# EasyEDA Pro project PCB.eprj, schematic Flags_Register
Board Name: Flags_Register; Create Date: 2025-08-07; Page Name: P1; Project Name: PCB; Schematic Name: Flags_Register; Update Date: 2025-08-12; Company: EasyEDA.com; Page Size: A4; Version: V1.0
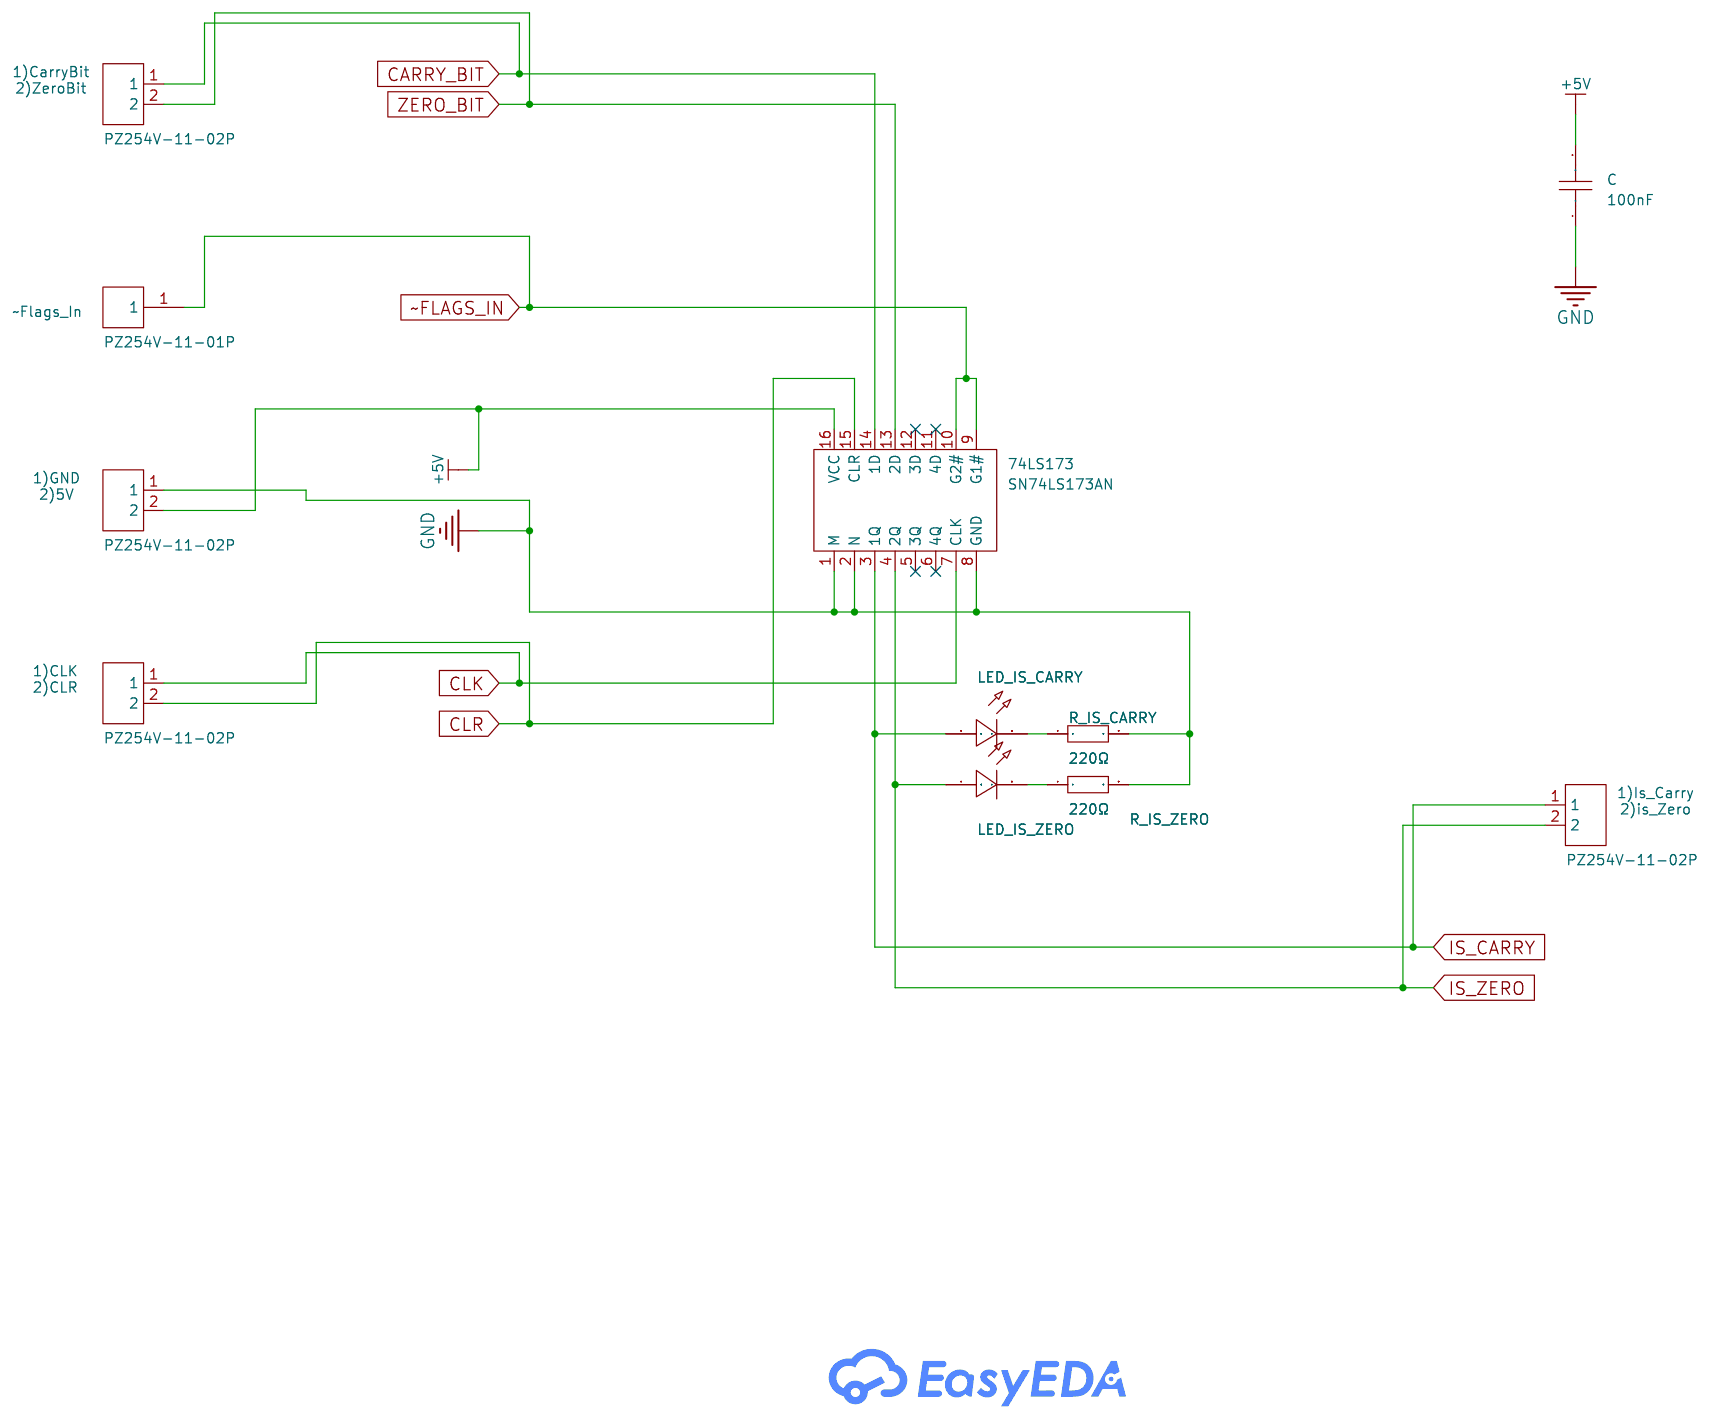
[diagram p2: schematic sheet]

## Parts
1)CarryBit
2)ZeroBit  PZ254V-11-02P  [HDR-TH_2P-P2.54-V-M]
1)CLK
2)CLR  PZ254V-11-02P  [HDR-TH_2P-P2.54-V-M]
1)GND
2)5V  PZ254V-11-02P  [HDR-TH_2P-P2.54-V-M]
1)Is_Carry
2)is_Zero  PZ254V-11-02P  [HDR-TH_2P-P2.54-V-M]
74LS173  SN74LS173AN  [PDIP-16_L19.3-W6.4-P2.54-LS7.94-BL]
C  100nF  [CAP-TH_L8.5-W5.0-P5.00-D1.2]
LED_IS_CARRY  -  [LED-TH_BD5.8-P2.54-FD]
LED_IS_ZERO  -  [LED-TH_BD5.8-P2.54-FD]
R_IS_CARRY  220Ω  [R_AXIAL-0.4]
R_IS_ZERO  220Ω  [R_AXIAL-0.4]
~Flags_In  PZ254V-11-01P  [HDR-TH_1P-P2.54-V-M]

## Library data of the parts
1)CarryBit
2)ZeroBit 1)CLK
2)CLR 1)GND
2)5V 1)Is_Carry
2)is_Zero = PZ254V-11-02P: LCSC Part Name: 1x2P 间距:2.54mm 方针 直插; Supplier Part: C492401; Manufacturer: XFCN(兴飞); Supplier Footprint: 插件,P=2.54mm; JLCPCB Part Class: Extended Part; Datasheet: https://atta.szlcsc.com/upload/public/pdf/source/20200309/C492401_A812433581A9B211A7FFA413ADDFF0E5.pdf; Supplier: LCSC; Pin Structure: 1x2P; Pitch: 2.54mm; Circluar Pins/Square Pins: Policy; Mounting Type: Straight; Number of Rows: Single Row; Number of Pins: 2P; Length of Mating Pin: 6mm; Insulation Height: 2.5mm; Length of End Connection Pin: 3mm; Contact Material: Brass; Operating Temperature: -40℃~+105℃; Color: Black
74LS173 = SN74LS173AN: Type:D-Type Trigger Type:Rising Edge Voltage - Supply:4.75V~5.25V Voltage - Supply:4.75V~5.25V Clock Frequency:50MHz Function:Reset Number of Elements:1 Number of Bits per Element:4 Output Type:- Propagation Delay:30ns@5V,45pF Series:74LS Series Current -; Supplier Part: C1550125; Manufacturer: TI(德州仪器); Supplier Footprint: PDIP-16; JLCPCB Part Class: Extended Part; Datasheet: https://www.ti.com/cn/lit/gpn/sn74ls173a; Supplier: LCSC; Type: D-Type; Trigger Type: Rising Edge; Voltage - Supply: 4.75V~5.25V; Clock Frequency: 50MHz; Function: Reset; Number of Elements: 1; Number of Bits per Element: 4; Propagation Delay: 30ns@5V,45pF; Series: 74LS Series; Current - Output Low(IOL): 24mA; Current - Output High(IOH): 2.6mA; Quiescent Current: 24mA; Operating Temperature: 0℃~+70℃
C = CT4-0805B104K500F3: LCSC Part Name: 100nF ±10% 50V C3型（直脚）; Supplier Part: C84772; Manufacturer: FH(风华); Supplier Footprint: 插件,P=5.08mm; JLCPCB Part Class: Extended Part; Datasheet: https://atta.szlcsc.com/upload/public/pdf/source/20190402/C385200_059806A6312B28FF1421A2413EB641E1.pdf; Supplier: LCSC; Tolerance: ±10%
LED_IS_CARRY LED_IS_ZERO = LED_TH-R_5mm: Supplier Footprint: Through
R_IS_CARRY R_IS_ZERO = Res_AXIAL-1/4W: Supplier Footprint: Through
~Flags_In = PZ254V-11-01P: LCSC Part Name: 1x1P 间距:2.54mm 方针 直插; Supplier Part: C492400; Manufacturer: XFCN(兴飞); Supplier Footprint: 插件,P=2.54mm; JLCPCB Part Class: Extended Part; Datasheet: https://atta.szlcsc.com/upload/public/pdf/source/20200309/C492400_46876A5B545F5AE6B8D4A09C46E276E8.pdf; Supplier: LCSC; Pin Structure: 1x1P; Pitch: 2.54mm; Circluar Pins/Square Pins: Policy; Mounting Type: Straight; Number of Rows: Single Row; Number of Pins: 1P; Length of Mating Pin: 6mm; Insulation Height: 2.5mm; Length of End Connection Pin: 3mm; Contact Material: Brass; Operating Temperature: -40℃~+105℃; Color: Black

## Nets
+5V: 1)GND
2)5V.2 74LS173.16(VCC) C.2
GND: 1)GND
2)5V.1 74LS173.1(M) 74LS173.2(N) 74LS173.8(GND) C.1 R_IS_CARRY.2 R_IS_ZERO.2
CARRY_BIT: 1)CarryBit
2)ZeroBit.1 74LS173.14(1D)
CLK: 1)CLK
2)CLR.1 74LS173.7(CLK)
CLR: 1)CLK
2)CLR.2 74LS173.15(CLR)
IS_CARRY: 1)Is_Carry
2)is_Zero.1 74LS173.3(1Q) LED_IS_CARRY.1(C)
IS_ZERO: 1)Is_Carry
2)is_Zero.2 74LS173.4(2Q) LED_IS_ZERO.1(C)
ZERO_BIT: 1)CarryBit
2)ZeroBit.2 74LS173.13(2D)
~FLAGS_IN: 74LS173.9(G1#) 74LS173.10(G2#) ~Flags_In.1
$1N333: LED_IS_ZERO.2(A) R_IS_ZERO.1
$1N334: LED_IS_CARRY.2(A) R_IS_CARRY.1

Not connected (* = marked no-connect by the designer): 74LS173 5(3Q)* 6(4Q)* 11(4D)* 12(3D)*
